# EasyEDA Pro project whf2023-12-25.epro

# Board PCB1_1
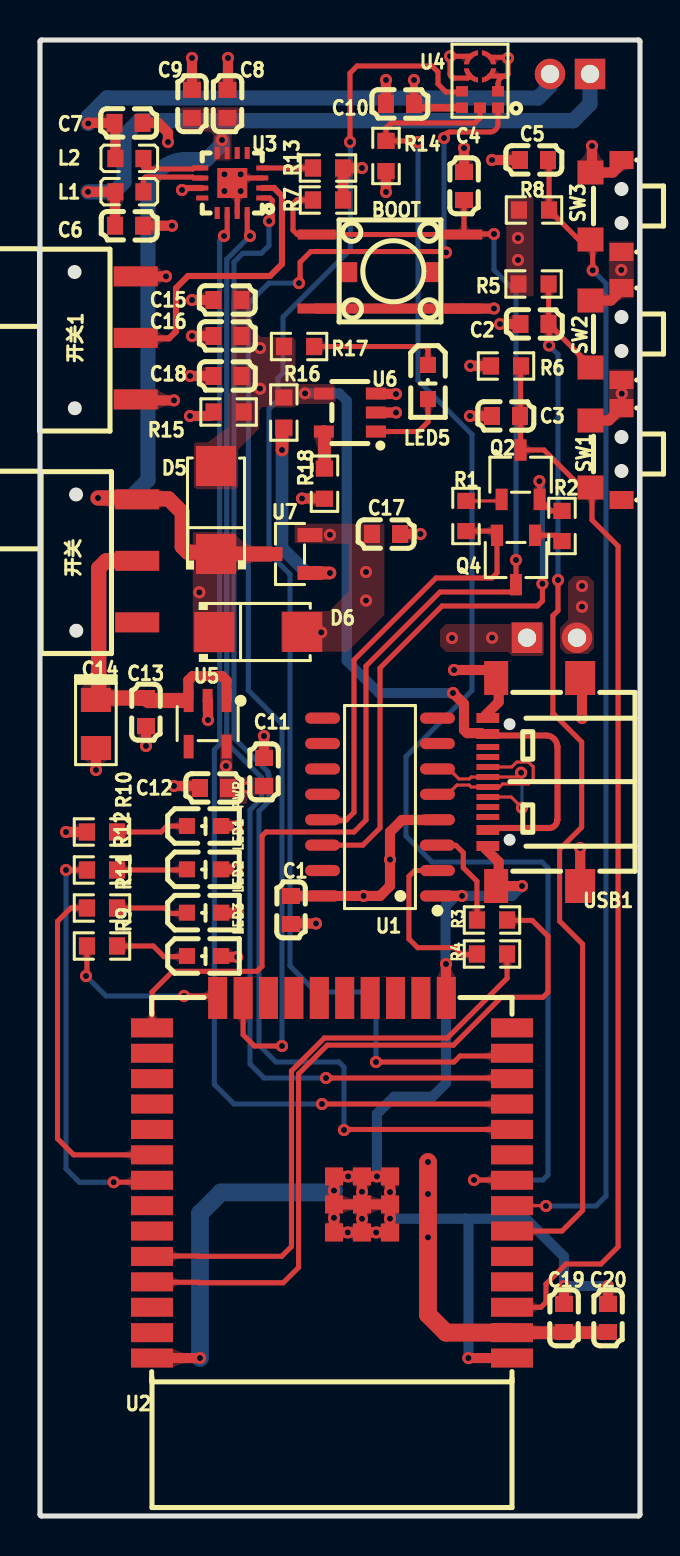
[diagram p0: board, top side]
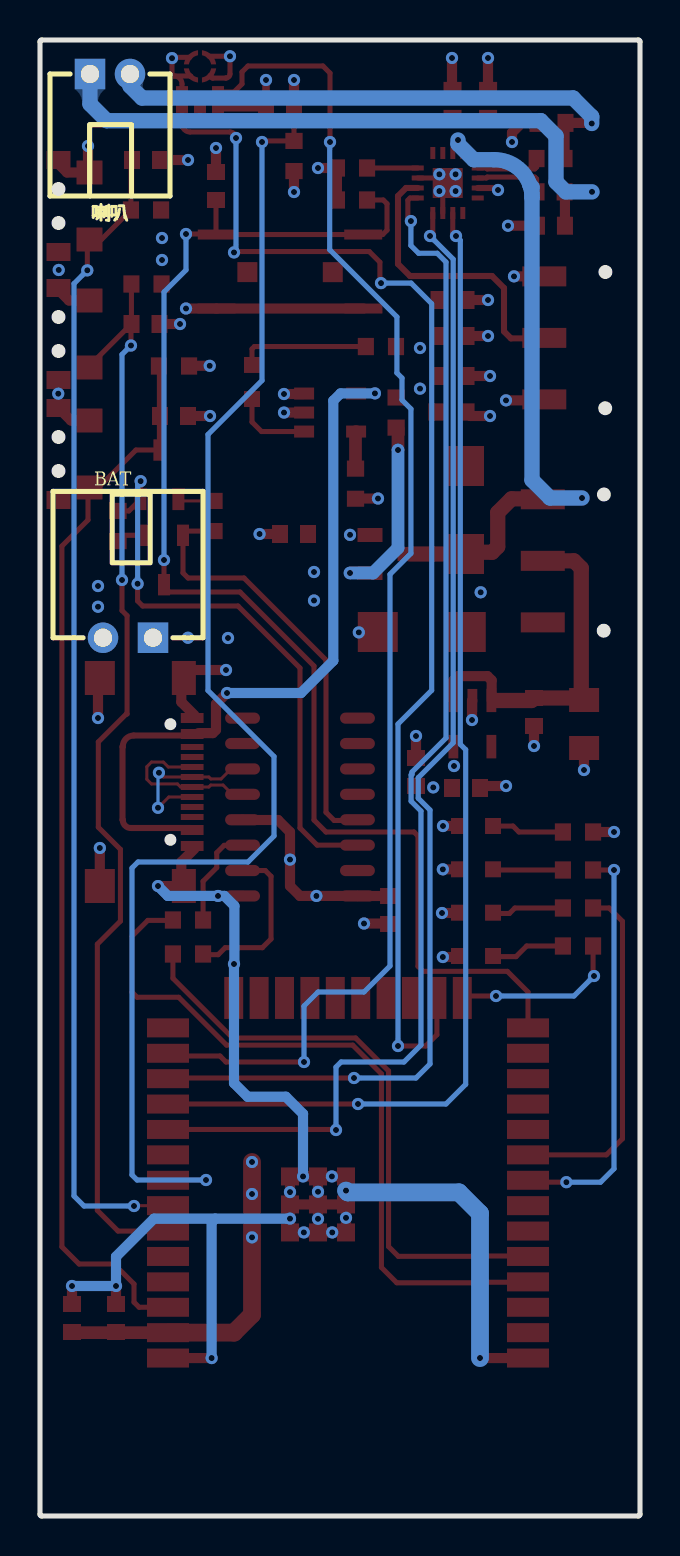
[diagram p1: board, bottom side, seen from below]

Outline 30 x 73.8 mm; copper layers: Top Layer, Inner1, Inner2, Bottom Layer. Coordinates in mm from the lower left corner of the outline.
Outline path: 0,73.72 0,0.08 arc(0.02,0.02) 0.08,0 29.92,0 arc(29.98,0.02) 30,0.08 30,73.72 arc(29.98,73.78) 29.92,73.8 0.08,73.8 arc(0.02,73.78) 0,73.72
Stack: Top Layer 0.035mm 外层铜厚1oz / Dielectric1 0.2104mm 7628 RC49% 8.6mil / Inner1 0.0152mm 内层铜厚 / Dielectric2 1.065mm 1.1mm H/HOZ 含铜 / Inner2 0.0152mm 内层铜厚 / Dielectric3 0.2104mm 7628 RC49% 8.6mil / Bottom Layer 0.035mm 外层铜厚1oz

## Design rules (mm)
net USB_DP: DP1
net USB_DN: DP1
net $1N25415: DP2
net $1N25437: DP2
template: 自定义配置
spacing copperThickness1oz: track to track 0.102, other pairs 0.025 to 0.3
spacing copperThickness2oz (default): track to track 0.203, other pairs 0 to 0.3
track width copperThickness1oz (default): min 0.127, default 0.254, max 2.54
track width PWR: min 0.152, default 0.533, max 2.54
differential pair differentialPair (default): width min 0.127, default 0.254, max 2.54; gap min 0.152, default 0.152
via viaSize (default): diameter min 0.5, default 0.61, max 10; hole min 0.254, default 0.305, max 6.299
net GND uses PWR, copperThickness1oz
net USB_DP uses copperThickness1oz
net USB_DN uses copperThickness1oz
net +3V3 uses PWR, copperThickness1oz
net $1N5849 uses copperThickness1oz
net TXD0 uses copperThickness1oz
net RXD uses copperThickness1oz
net RXD0 uses copperThickness1oz
net TXD uses copperThickness1oz
net DTR uses copperThickness1oz
net $1N6032 uses copperThickness1oz
net RTS uses copperThickness1oz
net $1N6044 uses copperThickness1oz
net EN uses copperThickness1oz
net IO32 uses copperThickness1oz
net IO25 uses copperThickness1oz
net IO26 uses copperThickness1oz
net IO27 uses copperThickness1oz
net IO14 uses copperThickness1oz
net IO15 uses copperThickness1oz
net IO0 uses copperThickness1oz

## Placement (name value [footprint] x y rotation side)
BAT  BX-XH2.54-2PWZ  [CONN-TH_2P-P2.50_BX-XH2.54-2PWZ]  25.6 43.91 0 bottom
BOOT  PTS645SH50SMTR92LFS  [KEY-SMD_4P-L6.0-W6.0-P4.50-LS9.0]  18 62.2 0 top
C1  100nF  [C0603]  12.55 30.3 270 top
C2  100nF  [C0603]  24.72 59.6 0 top
C3  100nF  [C0603]  23.3 55 0 top
C4  100nF  [C0603]  21.2 66.5 270 top
C5  100nF  [C0603]  24.7 67.8 0 top
C6  220pF  [C0603]  4.45 64.51 180 top
C7  220pF  [C0603]  4.43 69.66 180 top
C8  100nF  [C0603]  9.37 70.61 270 top
C9  10uF  [C0603]  7.6 70.61 270 top
C10  100nF  [C0603]  18 70.6 0 top
C11  100nF  [C0603]  11.2 37.2 270 top
C12  1uF  [C0603]  8.7 36.4 0 top
C13  1uF  [C0603]  5.3 40.2 90 top
C14  10UF16v钽电容A型  [CAP-SMD_L3.2-W1.6-FD]  2.79 39.6 270 top
C15  10uF  [C0603]  9.37 60.8 0 top
C16  100nF  [C0603]  9.37 59 0 top
C17  4.7uF  [C0603]  17.3 49.1 180 top
C18  4.7uF  [C0603]  9.37 57 0 top
C19  22uF  [C0603]  26.2 9.9 270 top
C20  100nF  [C0603]  28.4 9.9 270 top
D5  1N5819  [SMA_L4.3-W2.6-LS5.1-RD]  8.8 50.3 90 top
D6  1N5819  [SMA_L4.3-W2.6-LS5.1-RD]  10.91 44.2 0 top
L1  SBK160808T-101Y-N  [L0603]  4.47 66.21 0 top
L2  SBK160808T-101Y-N  [L0603]  4.47 67.87 0 top
LED1  MHT192WDT-ICE  [LED0603-R-RD_YELLOW]  8.2 32.33 0 top
LED2  NCD0603O1  [LED0603-R-RD_YELLOW]  8.2 30.17 0 top
LED3  XL-1608UGC-04  [LED0603-R-RD_YELLOW]  8.2 28 0 top
LED5  KT-0603R  [LED0603-R-RD_YELLOW]  19.4 56.7 270 top
PWR  XL-1608UVC-04  [LED0603-R-RD_YELLOW]  8.2 34.5 0 top
Q2  SS8050-G  [SOT-23-3_L2.9-W1.6-P1.90-LS2.8-BR]  24.03 52.06 270 top
Q4  SS8050-G  [SOT-23-3_L2.9-W1.6-P1.90-LS2.8-BR]  23.8 47.8 90 top
R1  10kΩ  [R0603]  21.3 50 270 top
R2  10kΩ  [R0603]  26.1 49.5 90 top
R3  0Ω  [R0603]  22.6 29.8 0 top
R4  0Ω  [R0603]  22.6 28.1 0 top
R5  10kΩ  [R0603]  24.68 61.6 180 top
R6  10kΩ  [R0603]  23.3 57.5 180 top
R7  10kΩ  [R0603]  14.4 65.8 180 top
R8  10kΩ  [R0603]  24.7 65.3 180 top
R9  5.1kΩ  [R0603]  3.1 28.5 0 top
R10  5.1kΩ  [R0603]  3.1 34.2 180 top
R11  5.1kΩ  [R0603]  3.1 30.4 0 top
R12  5.1kΩ  [R0603]  3.1 32.3 0 top
R13  1MΩ  [R0603]  14.4 67.4 180 top
R14  100kΩ  [R0603]  17.3 68 270 top
R15  10kΩ  [R0603]  9.43 55.2 0 top
R16  4.7kΩ  [R0603]  12.19 55.17 270 top
R17  5.1kΩ  [R0603]  12.95 58.47 0 top
R18  2kΩ  [R0603]  14.22 51.62 90 top
SW1  TS24CA  [SW-SMD_TS24CA]  28.3 53.1 270 top
SW2  TS24CA  [SW-SMD_TS24CA]  28.3 59.1 270 top
SW3  TS24CA  [SW-SMD_TS24CA]  28.3 65.5 270 top
U1  CH340C  [SOP-16_L10.0-W3.9-P1.27-LS6.0-BL]  17 35.45 90 top
U2  ESP32-WROOM-32E-N8  [WIFI-SMD_ESP32-WROOM-32E]  14.6 16.9 90 top
U3  MAX98357AETE+T  [TQFN-16_L3.0-W3.0-P0.50-BL-EP1.5]  9.61 66.65 90 top
U4  ICS-43434  [mic-smd_6p-l3.5-w2.7-p0.90-bl]  22 71.7 90 top
U5  RT9013-33GB  [SOT-23-5_L3.0-W1.7-P0.95-LS2.8-BL]  8.38 39.62 180 top
U6  MCP73831T-2ATI/OT  [SOT-23-5_L3.0-W1.7-P0.95-LS2.8-BR]  15.49 55.17 0 top
U7  AO3401A  [SOT-23-3_L2.9-W1.3-P1.90-LS2.4-BR]  12.5 48.1 0 top
USB1  TYPE-C 16P QTWT  [USB-TYPE-C-SMD_TYPE-C-16P-QTWT]  24.7 36.7 90 top
喇叭  BX-PH2.0-2PWZ  [CONN-TH_2P-P2.00_BX-PH2.0-2PWZ]  26.5 72.1 180 bottom
开关  -  [SW-TH_KH-SS12D11-G5#2]  2.79 47.81 270 top
开关1  -  [SW-TH_KH-SS12D11-G5]  1.8 58.9 270 top

## Footprints (pads in the part's own frame, mm; a bottom-side part is the same pattern mirrored in y, then rotated)
C0603
  rect 0.8x0.9 smd: 1(-0.7,0) 2(0.7,0)
CAP-SMD_L3.2-W1.6-FD
  rect 1.2x1.5 smd: 1(-1.2,0) 2(1.2,0)
CONN-TH_2P-P2.00_BX-PH2.0-2PWZ
  rect 1.524x1.524 hole 0.914: 1(-1,0)
  round 1.524 hole 0.914: 2(1,0)
CONN-TH_2P-P2.50_BX-XH2.54-2PWZ
  rect 1.524x1.524 hole 0.914: 1(-1.25,0)
  round 1.524 hole 0.914: 2(1.25,0)
KEY-SMD_4P-L6.0-W6.0-P4.50-LS9.0
  rect 1.9x0.5 smd: 1(-4.162,1.873) 2(3.163,1.873) 3(-4.171,-1.827) 4(3.172,-1.827)
  rect 1x1 smd: 5(-2.638,-0.007) 6(1.631,-0.005)
L0603
  rect 0.8x0.864 smd: 1(-0.7,0) 2(0.7,0)
LED0603-R-RD_YELLOW
  rect 0.8x0.8 smd: 1(0.851,0) 2(-0.851,0)
mic-smd_6p-l3.5-w2.7-p0.90-bl
  rect 0.52x0.6 smd: 1(-1.286,-0.9) 2(-0.465,-0.9) 4(-0.465,0.9) 5(-1.286,0.9) 6(-1.286,0)
  custom 0.709x0.71 smd: 3(0.276,-0.453) 3(0.329,0.505) 3(1.234,-0.505) 3(1.286,0.452)
R0603
  rect 0.806x0.864 smd: 1(-0.753,0) 2(0.753,0)
SMA_L4.3-W2.6-LS5.1-RD
  rect 2x2 smd: 1(-2.2,0) 2(2.2,0)
SOP-16_L10.0-W3.9-P1.27-LS6.0-BL
  oval 0.56x1.745 smd: 1(-4.445,-2.873) 2(-3.175,-2.873) 3(-1.905,-2.873) 4(-0.635,-2.873) 5(0.635,-2.873) 6(1.905,-2.873) 7(3.175,-2.873) 8(4.445,-2.873) 9(4.445,2.873) 10(3.175,2.873) 11(1.905,2.873) 12(0.635,2.873) 13(-0.635,2.873) 14(-1.905,2.873) 15(-3.175,2.873) 16(-4.445,2.873)
SOT-23-3_L2.9-W1.3-P1.90-LS2.4-BR
  rect 1.25x0.7 smd: 1(1,-0.95) 2(1,0.95) 3(-1,0)
SOT-23-3_L2.9-W1.6-P1.90-LS2.8-BR
  rect 1.07x0.6 smd: 1(1.235,-0.95) 2(1.235,0.95) 3(-1.235,0)
SOT-23-5_L3.0-W1.7-P0.95-LS2.8-BL
  rect 0.49x1.157 smd: 1(-0.95,-1.153) 2(0,-1.153) 3(0.95,-1.153)
  rect 0.49x1.175 smd: 4(0.95,1.153) 5(-0.95,1.153)
SOT-23-5_L3.0-W1.7-P0.95-LS2.8-BR
  rect 1x0.6 smd: 1(1.3,-0.95) 2(1.3,0) 3(1.3,0.95) 4(-1.3,0.95) 5(-1.3,-0.95)
SW-SMD_TS24CA
  rect 0.9x1.2 smd: 1(-2.3,0.775) 2(2.3,0.775)
  rect 1.2x1.3 smd: 3(-1.675,-0.775) 4(1.675,-0.775)
SW-TH_KH-SS12D11-G5
  rect 1x2.2 smd: 1(-3.082,2.986) 2(-0.005,2.986) 3(3.071,2.986)
SW-TH_KH-SS12D11-G5#2
  rect 1x2.2 smd: 1(-3.027,2.067) 2(0.049,2.067) 3(3.124,2.067)
TQFN-16_L3.0-W3.0-P0.50-BL-EP1.5
  rect 0.25x0.6 smd: 1(-0.749,-1.5) 2(-0.248,-1.5) 3(0.252,-1.5) 4(0.751,-1.5) 9(0.75,1.5) 10(0.25,1.5) 11(-0.25,1.5) 12(-0.749,1.5)
  rect 0.6x0.25 smd: 5(1.5,-0.748) 6(1.5,-0.248) 7(1.5,0.252) 8(1.5,0.752) 13(-1.5,0.752) 14(-1.5,0.252) 15(-1.5,-0.248) 16(-1.5,-0.748)
  rect 1.5x1.5 smd: 17(0,0)
USB-TYPE-C-SMD_TYPE-C-16P-QTWT
  rect 1.7x1.2 smd: 0(-5.2,1.891) 0(5.2,1.891)
  rect 1.7x1.5 smd: 0(-5.2,-2.309) 0(5.2,-2.309)
  rect 0.5x1.14 smd: A1(-3.2,2.308) A4(-2.4,2.308) A9(2.4,2.308) A12(3.2,2.308)
  rect 0.3x1.14 smd: A5(-1.25,2.308) A6(-0.25,2.308) A7(0.25,2.308) A8(1.25,2.309) B5(1.75,2.308) B6(0.75,2.308) B7(-0.75,2.308) B8(-1.75,2.309)
WIFI-SMD_ESP32-WROOM-32E
  rect 0.95x2.1 smd: 1(-9.002,-9) 2(-7.732,-9) 3(-6.463,-9) 4(-5.192,-9) 5(-3.922,-9) 6(-2.652,-9) 7(-1.383,-9) 8(-0.113,-9) 9(1.157,-9) 10(2.428,-9) 11(3.697,-9) 12(4.968,-9) 13(6.237,-9) 14(7.508,-9) 25(7.508,9) 26(6.237,9) 27(4.968,9) 28(3.697,9) 29(2.428,9) 30(1.157,9) 31(-0.113,9) 32(-1.383,9) 33(-2.652,9) 34(-3.922,9) 35(-5.192,9) 36(-6.463,9) 37(-7.732,9) 38(-9.002,9)
  rect 2.1x0.95 smd: 15(9.002,-5.715) 16(9.002,-4.445) 17(9.002,-3.175) 18(9.002,-1.905) 19(9.002,-0.635) 20(9.002,0.635) 21(9.002,1.905) 22(9.002,3.175) 23(9.002,4.445) 24(9.002,5.715)
  rect 0.9x0.9 smd: 39(-2.721,-0.1) 39(-2.721,-1.5) 39(-2.721,-2.9) 39(-1.321,-0.1) 39(-1.321,-1.5) 39(-1.321,-2.9) 39(0.079,-0.1) 39(0.079,-1.5) 39(0.079,-2.9)

## Nets
+3V3: C1.1 C10.2 C11.2 C12.2 C19.2 C20.2 R5.2 R6.2 R7.1 R8.2 R10.2 R13.1 U1.4 U1.16 U2.2 U4.5 U5.5 开关1.3
GND: BAT.2 BOOT.3 BOOT.4 C1.2 C2.1 C3.1 C4.1 C5.1 C6.1 C7.1 C8.1 C9.1 C10.1 C11.1 C12.1 C13.1 C14.2 C15.1 C16.1 C17.1 C18.1 C19.1 C20.1 LED1.1 LED2.1 LED3.1 PWR.1 R14.2 R15.1 R18.1 SW1.1 SW1.3 SW2.1 SW2.2 SW2.3 SW3.1 SW3.2 SW3.3 U1.1 U2.1 U2.15 U2.38 U2.39 U3.3 U3.11 U3.15 U3.17 U4.2 U4.3 U5.2 U6.2 USB1.0 USB1.A1 USB1.A12 开关1.1
VBAT: BAT.1 C17.2 D6.2 U6.3 U7.2
VBAT1: C8.2 C9.2 D5.1 D6.1 U3.7 U3.8 U7.3 开关.1
VBUS: C15.2 C16.2 C18.2 D5.2 R15.2 R16.1 R17.1 U6.4 USB1.A4 USB1.A9
DTR: Q4.2 R1.2 U1.13
EN: C3.2 Q2.3 R6.1 SW1.4 U2.3
IO0: BOOT.1 BOOT.2 C4.2 Q4.3 R7.2 U2.25
IO2: R9.1 U2.24
IO14: U2.13 U4.4
IO15: U2.23 U4.1
IO18: R11.1 U2.30
IO19: R12.1 U2.31
IO25: U2.10 U3.1
IO26: U2.11 U3.14
IO27: U2.12 U3.16
IO32: R14.1 U2.8 U4.6
IO34: C2.2 R5.1 SW2.4 U2.6
IO35: C5.2 R8.1 SW3.4 U2.7
RTS: Q2.2 R2.2 U1.14
RXD: R3.1 U1.3
RXD0: R4.2 U2.34
TXD: R4.1 U1.2
TXD0: R3.2 U2.35
USB_DN: U1.6 USB1.A7 USB1.B7
USB_DP: U1.5 USB1.A6 USB1.B6
$1N5849: PWR.2 R10.1
$1N6032: Q2.1 R1.1
$1N6044: Q4.1 R2.1
$1N25400: C7.2 L2.1 喇叭.2
$1N25412: C6.2 L1.1 喇叭.1
$1N25415: L1.2 U3.10
$1N25437: L2.2 U3.9
$1N29466: R13.2 U3.4
$1N57283: R18.2 U6.5
$1N57328: LED5.2 R17.2
$1N58084: R16.2 U7.1
$1N62317: U3.2 开关1.2
$1N68728: LED3.2 R9.2
$1N68776: LED2.2 R11.2
$1N68824: LED1.2 R12.2
$1N75969: LED5.1 U6.1
$1N77791: C13.2 C14.1 U5.1 U5.3 开关.2

Pads without a net: BOOT 5 6; SW1 2; U1 7 8 9 10 11 12 15; U2 4 5 9 14 16 17 18 19 20 21 22 26 27 28 29 32 33 36 37; U3 5 6 12 13; U5 4; USB1 A5 A8 B5 B8; 开关 3

## Via types
v1: diameter 0.61, hole 0.305, Top Layer to Bottom Layer, 121 vias

## Routing (per net, layer and track width the routed paths; a pad name or vN(x,y) marks a point on that pad's centre or on a via; arc(x,y) is an arc through that point)
+3V3: length 37.7
  Top Layer w0.381: U4.5 18.89,70.41 arc(18.75,70.47) C10.2 v1(18.7,71.8)
  Top Layer w0.508: v1(1.3,34.2) R10.2 ; U1.4 19.86,34.8 18.1,34.8 17.5,34.2 v1(17.5,32.82) 17.5,31.5 17,31 v1(16.18,31) U1.16 14.12,31 12.6,31 ; v1(6.7,55.78) 4.79,55.78 ; R6.2 22.54,57.51 v1(21.51,57.51) ; v1(16.1,67.4) R13.1 R7.1
  Top Layer w0.635: U2.2 28.37,9.17 C20.2
  Top Layer w0.889: v1(19.4,17.7) v1(19.4,16.1) v1(19.4,13.93) 19.4,10.07 20.3,9.17 U2.2
  vias: v1(9.3,37.5) v1(10.34,36.43) v1(23.9,63.9) v1(23.9,62.8)
GND: length 150.4
  Top Layer w0.254: U3.15 9.86,66.4 9.61,66.65 9.87,66.9 U3.3 ; U4.2 22.9,71.6 arc(23.02,71.88) 23.3,72 ; U4.3 23.27,72.93 arc(23.36,72.89) 23.4,72.8 23.4,72.1 arc(23.37,72.03) 23.3,72 ; 23.3,72 22.48,72 arc(22.46,71.99) U4.3 ; U4.3 20.69,72.99 arc(20.55,72.93) 20.5,72.8 20.5,72.1 arc(20.56,71.96) 20.7,71.9 20.7,71.9 21.36,71.9 21.37,71.9 arc(21.46,71.94) U4.3
  Top Layer w0.305: v1(7.1,66.3) 7.2,66.4 U3.11
  Top Layer w0.508: v1(9.86,32.33) 9.11,32.33 ; 22.28,33.35 22.94,32.7 22.94,32.38 ; U2.15 20.3,25.92 v1(20.3,27.6) ; C7.1 5.91,69.66 6.4,69.17 v1(6.4,68.7) ; v1(6.7,36.5) 7.9,36.5 C12.1 ; U2.39 v1(16.1,16.21) U2.39 ; U2.39 U2.39 ; U2.39 v1(16.1,14.86) U2.39 ; U2.39 U2.39 ; 27.01,31.5 v1(27.01,33.4) ; v1(7.5,55) 8.47,55 R15.1 ; 29.28,67.8 28.65,67.18 27.72,67.18 27.6,67.3 v1(27.6,68.5) ; 22.94,41.02 22.94,40.7 22.28,40.05 ; 22.81,41.9 22.41,42.3 v1(20.7,42.3) ; 29.18,61.4 28.55,60.78 27.62,60.78 ; U2.39 v1(14.7,16.27) U2.39 v1(15.41,16.98) U2.39 ; U2.39 v1(14.7,14.91) U2.39 v1(15.39,14.18) U2.39 ; v1(6.6,64.51) C6.1 ; v1(22.6,67.8) C5.1 ; v1(11.2,39) C11.1 ; U2.39 v1(16.85,16.98) U2.39 v1(17.5,16.2) U2.39 ; v1(27.1,39.9) 27.1,41.81 27.01,41.9 ; v1(6.3,61.98) 开关1.1 ; U2.39 v1(16.81,14.18) U2.39 v1(17.5,14.87) U2.39 ; C9.1 7.6,71.31 v1(7.6,72.9) ; v1(17.3,66.2) R14.2 ; v1(26.2,11.5) C19.1 ; R18.1 14.21,50.87 v1(13.1,50.87) ; 12.6,29.65 12.63,29.62 v1(13.8,29.62) ; v1(9.4,72.9) 9.4,71.33 C8.1 ; 9.06,30.17 9.08,30.15 v1(9.9,30.15) ; SW1.1 28.45,54.78 SW1.3 ; v1(28.4,11.5) C20.1 ; v1(21.1,31) U1.1 ; U6.2 v1(17.8,55.17) ; v1(9.85,34.5) PWR.1 ; v1(7.6,60.8) C15.1 ; v1(2.8,37.3) 2.8,38.3 2.7,38.4 ; v1(21.2,68.4) C4.1 ; v1(5.3,38.5) C13.1 ; v1(23,59.6) C2.1 ; v1(17.3,71.8) C10.1 ; v1(24.1,31.5) 22.81,31.5 ; v1(9.86,27.95) 9.11,27.95 ; v1(22.7,60.37) BOOT.4 BOOT.3 ; U5.2 8.4,40.76 v1(8.4,39.8) ; v1(19.02,49.1) C17.1 ; v1(7.5,57) C18.1 ; v1(21.5,55) C3.1 ; v1(8,7.9) U2.38 ; U2.1 v1(21.42,7.9) ; v1(7.6,59) C16.1
  Bottom Layer w0.508: v1(17.8,55.17) 17.81,55.17 ; 21.23,14.87 24.3,14.87 26.2,12.97 v1(26.2,11.5) v1(28.4,11.5) ; 21.23,14.87 21.42,14.68 v1(21.42,7.9) ; 21.23,14.87 v1(17.5,14.87) ; v1(24.1,31.5) 23.6,31 v1(21.1,31) ; v1(27.01,33.4) 27,33.4 ; v1(21.1,31) 21.1,31 ; v1(21.1,31) 20.78,31 20.28,30.5 20.28,27.62 v1(20.3,27.6) 20.3,21.65 19.62,20.96 17.71,20.96 16.85,20.11 v1(16.85,16.98)
  Bottom Layer w0.889: v1(8,7.9) 8,15.13 9.05,16.18 14.61,16.18 v1(14.7,16.27)
  vias: v1(9.22,67.08) v1(9.22,66.25) v1(10.03,67.08) v1(10.03,66.25) v1(20.5,72.99) v1(23.4,72.89) v1(27.1,46.5) v1(27.1,45.46) v1(29.06,62.3) v1(29.09,56.12)
VBAT: length 1
  Top Layer w0.508: v1(17.8,56.1) 16.82,56.1 U6.3
  vias: v1(14.06,44.18) v1(14.5,49.06) v1(16.3,47.2) v1(16.3,45.77) v1(20.6,43.9) v1(22.6,43.91)
VBAT1: length 33.7
  Top Layer w0.762: v1(2.9,50.9) 4.82,50.9 4.86,50.86 6.43,50.86 7.11,50.17 7.11,48.47 7.39,48.19 8.71,48.19 D5.1 U7.3
  Bottom Layer w0.762: 5.4,65.93 5.4,66.44 5.5,66.54 ; 5.4,65.93 5.4,51.8 4.5,50.9 v1(2.9,50.9) ; 5.4,65.93 arc(5.43,66.24) 5.5,66.54 ; v1(9.1,68.8) 9.1,68.6 8.32,67.82 7.28,67.82 arc(6.19,67.46) 5.5,66.54
  vias: v1(7.97,46.18)
VBUS: length 35.5
  Top Layer w0.305: 22.39,34.3 22.49,34.4 25.46,34.4 arc(25.74,34.52) 25.86,34.8 25.87,34.81 25.87,38.46 25.86,38.48 arc(25.7,38.86) 25.31,39.03 22.46,39.03 arc(22.41,39.05) 22.39,39.1
  Top Layer w0.508: v1(20.65,41.15) 21.2,40.6 21.2,39.31 21.36,39.14 22.08,39.14
  Bottom Layer w0.508: v1(13.25,56.13) 14.97,56.13 15.34,55.77 15.34,42.77 16.95,41.15 v1(20.65,41.15)
  vias: v1(11,58.4) v1(11,56.37)
DTR: length 21.8
  Top Layer w0.254: R1.2 22.64,49.25 Q4.2 22.85,47.15 22.6,46.9 19.8,46.9 15.7,42.8 15.7,35.19 15.29,34.78 14.16,34.78 U1.13
EN: length 54.1
  Top Layer w0.254: U2.3 25.05,10.44 25.3,10.69 25.3,11.6 26.3,12.6 28.05,12.6 28.91,13.46 28.91,48.5 27.6,49.8 27.6,51.35 SW1.4 27.07,51.43 25.2,53.3 Q2.3 24.03,57.48 R6.1
IO0: length 69.1
  Top Layer w0.254: v1(23.8,47.8) Q4.3 23.8,46.45 23.55,46.2 20,46.2 16.3,42.5 16.3,34.8 15.7,34.2 11.3,34.2 11.1,34 11.1,27.49 10.85,27.23 6.63,27.23 5.6,26.2 U2.25 ; 21.19,64.1 21.2,64.11 C4.2 ; 21.19,64.1 v1(22.7,64.1) ; 21.19,64.1 BOOT.2 BOOT.1 12.87,64.07 12.65,64.29 12.65,65.61 12.84,65.8 R7.2
  Bottom Layer w0.254: v1(23.8,47.8) 23.8,61.2 22.7,62.3 v1(22.7,64.1)
IO2: length 8.6
  Top Layer w0.254: v1(7.2,26) 8.79,26 U2.24 ; v1(2.3,27) 2.35,27.05 R9.1
  Bottom Layer w0.254: v1(2.3,27) 3.3,26 v1(7.2,26)
IO14: length 68.3
  Top Layer w0.254: U2.13 23.46,23 21,23 20.7,22.7 v1(16.8,22.7) ; v1(15.5,68.7) 15.5,72.15 15.85,72.5 19.6,72.5 19.9,72.2 19.9,71.6 20.3,71.2 21.06,71.2 U4.4
  Bottom Layer w0.254: v1(16.8,22.7) 16.8,25.5 16.1,26.2 13.8,26.2 12.5,27.5 12.5,47.08 11.45,48.13 11.45,55.35 11.9,55.8 11.9,56.9 12.15,57.15 12.15,59.95 15.52,63.32 15.52,68.68 v1(15.5,68.7)
IO15: length 63.1
  Top Layer w0.254: U2.23 10.16,24.06 10.72,23.5 v1(12.1,23.5) ; v1(12.95,61.64) 13,61.7 13,62.69 13.54,63.22 20.25,63.22 v1(20.3,63.18) ; U4.1 22.9,69.6 arc(22.78,69.32) 22.5,69.2 20.5,69.2 arc(20.29,69.11) v1(20.2,68.9)
  Bottom Layer w0.254: v1(12.95,61.64) 11.44,61.64 10.42,60.62 10.42,41.28 12.1,39.6 v1(12.1,23.5) ; v1(20.2,68.9) 20.2,63.28 v1(20.3,63.18)
IO18: length 17.7
  Top Layer w0.254: U2.30 1.68,18.06 0.88,18.86 0.88,29.73 1.54,30.4 R11.1
IO19: length 20.6
  Top Layer w0.254: v1(3.68,16.69) 5.5,16.69 U2.31 ; R12.1 v1(1.3,32.3)
  Bottom Layer w0.254: v1(1.3,32.3) 1.3,17.36 1.97,16.69 v1(3.68,16.69)
IO25: length 61.3
  Top Layer w0.254: v1(15.2,19.3) 15.23,19.33 U2.10 ; U3.1 11.5,65.9 11.61,65.79 11.61,64.9 v1(11.46,64.75)
  Bottom Layer w0.254: v1(11.46,64.75) 11.46,63.52 11.07,63.14 10.14,63.14 9.7,62.7 9.7,38.9 11.4,37.2 11.4,37.08 11.44,37.06 11.44,35.74 10.95,35.25 10.95,23.55 11.8,22.7 14.95,22.7 15.2,22.45 v1(15.2,19.3)
IO26: length 59.1
  Top Layer w0.254: U3.14 9.36,64.16 v1(9.2,64) ; U2.11 23.6,20.6 v1(14.1,20.6)
  Bottom Layer w0.254: v1(14.1,20.6) 9.7,20.6 8.72,21.58 8.72,38.32 8.98,38.58 8.98,63.78 v1(9.2,64) 9.19,64
IO27: length 57.5
  Top Layer w0.254: U3.16 10.36,64.14 v1(10.5,64) ; v1(14.3,21.9) 23.57,21.9 U2.12
  Bottom Layer w0.254: v1(14.3,21.9) 11.2,21.9 10.5,22.6 10.5,35.3 11.09,35.89 11.09,36.91 9.34,38.66 9.34,62.84 v1(10.5,64) 10.53,64 10.54,64.01
IO32: length 73.7
  Top Layer w0.254: v1(21.7,16.8) 23.59,16.8 U2.8 ; U4.6 22,69.9 21.76,69.66 17.56,69.66 17.3,69.4 R14.1 18.85,68.75 v1(18.9,68.7)
  Bottom Layer w0.254: v1(21.7,16.8) 25.15,16.8 25.4,17.05 25.4,32.4 25.1,32.7 19.6,32.7 18.3,34 18.3,37.98 21.6,41.28 21.6,54.07 18.9,56.77 v1(18.9,68.7)
IO34: length 55.2
  Top Layer w0.152: 25.43,59.61 C2.2
  Top Layer w0.254: U2.6 26.1,14.25 27.13,15.28 27.13,28.59 25.98,29.74 25.98,33.33 27.08,34.44 27.08,38.7 25.69,40.1 25.65,40.1 25.65,45.02 25.9,45.27 v1(25.9,46.8) ; 27.62,57.43 27.61,57.43 25.43,59.61 R5.1 ; C2.2 25.45,59.57 v1(25.45,58.53)
  Bottom Layer w0.254: v1(25.45,58.53) 25.9,58.08 v1(25.9,46.8)
IO35: length 58.5
  Top Layer w0.152: U2.7 25.32,15.52 25.31,15.5 v1(25.3,15.5)
  Top Layer w0.254: C5.2 25.45,67.75 R8.1 26.93,63.83 27.72,63.83 27.63,63.74 v1(27.63,62.28)
  Bottom Layer w0.254: v1(25.3,15.5) 27.8,15.5 28.3,16 28.3,61.62 v1(27.63,62.28)
RTS: length 29.1
  Top Layer w0.254: U1.14 16.14,33.54 17,34.4 17,42.4 20.1,45.5 24.87,45.5 25.12,45.75 v1(25.12,46.61) ; R2.2 25.56,50.25 Q2.2 24.98,51.73 v1(24.97,51.74)
  Bottom Layer w0.254: v1(25.12,46.61) 25.12,51.59 v1(24.97,51.74) 24.97,51.73
RXD: length 5.1
  Top Layer w0.254: R3.1 21.85,31.74 21.16,32.42 21.16,33.16 20.79,33.53 19.88,33.53 U1.3
RXD0: length 29.9
  Top Layer w0.254: U2.34 5.62,13 7.9,13 7.92,12.98 12.08,12.98 12.57,13.47 12.57,22.25 14.22,23.9 20.37,23.9 23.35,26.89 R4.2
TXD: length 8.4
  Top Layer w0.254: U1.2 18.74,32.27 18.45,31.98 18.45,28.85 18.88,28.42 20.74,28.42 21.09,28.07 21.81,28.07 R4.1
TXD0: length 36.7
  Top Layer w0.254: R3.2 23.37,29.78 24.61,29.78 25.4,28.99 25.4,26.19 25.15,25.94 23.06,25.94 20.67,23.54 14.37,23.54 12.93,22.11 12.93,12.43 12.16,11.66 7.95,11.66 7.93,11.69 5.62,11.69 U2.35
USB_DN: length 8.4
  Top Layer w0.152: U1.6 20.45,37.35 20.95,36.85 21.46,36.85 21.56,36.95 USB1.A7 23.84,36.95 v1(24.05,37.16) ; v1(24.1,35.41) 23.56,35.95 22.28,35.95
  Bottom Layer w0.152: v1(24.1,35.41) 24.1,37.12 v1(24.05,37.16) 24,37.16
USB_DP: length 8.4
  Top Layer w0.152: 22.28,37.45 23.59,37.45 23.83,37.7 24.42,37.7 24.66,37.46 24.66,36.84 24.43,36.6 23.13,36.6 22.97,36.45 USB1.A6 21.56,36.45 21.46,36.55 20.85,36.55 20.38,36.08 U1.5
$1N5849: length 3.6
  Top Layer w0.254: PWR.2 7.35,34.5 6.35,34.5 6.05,34.2 R10.1
$1N6032: length 1.8
  Top Layer w0.152: Q2.1 23,50.75 R1.1
$1N6044: length 1.5
  Top Layer w0.254: Q4.1 25.81,49.04 R2.1
$1N25400: length 27.8
  Top Layer w0.508: L2.1 3.77,69.61 C7.2 2.44,69.66 v1(2.41,69.62)
  Bottom Layer w0.762: 喇叭.2 25.5,71.5 24.9,70.9 3.34,70.9 2.41,69.97 v1(2.41,69.62)
$1N25412: length 32.8
  Top Layer w0.508: v1(2.4,66.21) L1.1 3.75,66.19 C6.2
  Bottom Layer w0.762: v1(2.4,66.21) 3.71,66.21 4.2,66.7 4.2,69 4.96,69.77 26.66,69.77 27.5,70.6 喇叭.1
$1N25415: length 3.6
  Top Layer w0.254: U3.10 7.69,66.9 7.64,66.95 5.26,66.95 5.17,66.86 L1.2
$1N25437: length 3.4
  Top Layer w0.254: U3.9 7.69,67.4 7.64,67.35 5.26,67.35 5.17,67.44 L2.2
$1N29466: length 2.5
  Top Layer w0.254: R13.2 U3.4
$1N57283: length 1.9
  Top Layer w0.635: U6.5 14.22,54.19 R18.2
$1N57328: length 6.3
  Top Layer w0.254: R17.2 19.28,58.47 19.4,58.35 19.4,57.8
$1N58084: length 10
  Top Layer w0.635: R16.2 12.1,54.33 v1(12.1,53.3) ; v1(14.5,47.15) 13.5,47.15
  Bottom Layer w0.635: v1(12.1,53.3) 12.1,48.4 13.35,47.15 v1(14.5,47.15)
$1N62317: length 14.7
  Top Layer w0.305: U3.2 11.7,66.4 12.1,66 12.1,62.6 11.5,62 7.4,62 6.8,61.4 6.8,59.23 6.45,58.88 4.79,58.88
$1N68728: length 3.7
  Top Layer w0.254: R9.2 5.67,28.5 6.2,27.97 7.32,27.97 LED3.2
$1N68776: length 3.6
  Top Layer w0.254: LED2.2 7.31,30.13 6.53,30.13 6.26,30.4 R11.2
$1N68824: length 3.5
  Top Layer w0.254: 7.35,32.33 7.32,32.3 R12.2
$1N75969: length 4
  Top Layer w0.254: U6.1 18.92,54.22 19.4,54.7 LED5.1
$1N77791: length 17.3
  Top Layer w0.508: U5.1 9.33,41.77 9.11,41.99 7.62,41.99 7.42,41.79 7.42,40.79
  Top Layer w0.762: 2.7,40.8 2.8,40.9 ; 2.8,40.9 C13.2 5.43,40.77 7.17,40.77 ; 2.8,40.9 2.94,41.04 2.94,47.39 3.3,47.76 开关.2

## Copper pours and planes (outline as drawn; the poured copper is in the pictures)
+3V3 on Top Layer: 23.31,65.96 24.68,65.96 24.68,60.99 23.31,60.99
+3V3 on Top Layer: 8.97,39.12 11.71,39.12 11.71,35.62 8.97,35.62
+3V3 on Inner2: 0.26,73.54 29.74,73.54 29.74,13.37 0.26,13.37
GND on Top Layer: 26,47 27.7,47 27.7,43.1 26,43.1
GND on Top Layer: 28.45,63.72 29.68,63.72 29.68,60.88 28.45,60.88
GND on Top Layer: 28.45,57.33 29.68,57.33 29.68,54.9 28.45,54.9
GND on Inner1: 0.26,73.54 29.74,73.54 29.74,13.4 0.26,13.4
VBAT on Top Layer: 20,44.7 25.2,44.7 25.2,43 20,43
VBAT on Top Layer: 12.06,49.61 17.22,49.61 17.22,43.21 12.06,43.21
VBAT on Inner2: 11.87,56.18 29.74,56.18 29.74,40.58 11.87,40.58
VBAT1 on Top Layer: 7.04,70.44 9.96,70.44 9.96,67.77 7.04,67.77
VBAT1 on Top Layer: 7.64,49.2 9.74,49.2 9.74,43.17 7.64,43.17
VBUS on Top Layer: 11.81,56.56 14.69,56.56 14.69,55.7 11.81,55.7
VBUS on Top Layer: 7.7,61.4 14.78,61.4 14.78,51.34 7.7,51.34
VBUS on Top Layer: 11.68,58.92 12.7,58.92 12.7,55.43 11.68,55.43

Small or netless copper shapes (teardrops, artwork), in the pictures only: 215 on Top Layer, 22 on Bottom Layer, 4 on Inner1, 4 on Inner2
